# Altium schematic sheet Processor_3.SchDoc
size 420 x 297 mm; CmpIndex: 88; SymIndex: 30
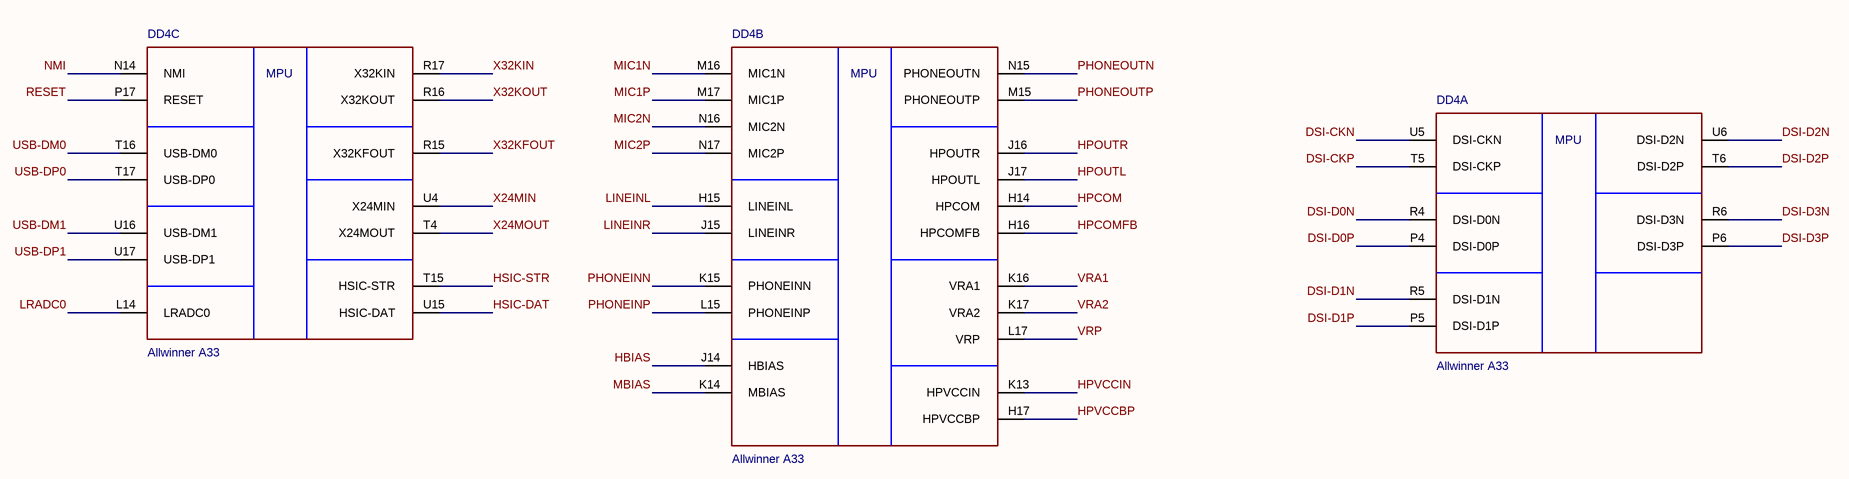
[diagram p0: Processor_3.SchDoc]

## Parts
DD4  Allwinner A33  (parts A,B,C of 7)

## Nets
DSI-CKN: DD4.U5(DSI-CKN)
DSI-CKP: DD4.T5(DSI-CKP)
DSI-D0N: DD4.R4(DSI-D0N)
DSI-D0P: DD4.P4(DSI-D0P)
DSI-D1N: DD4.R5(DSI-D1N)
DSI-D1P: DD4.P5(DSI-D1P)
DSI-D2N: DD4.U6(DSI-D2N)
DSI-D2P: DD4.T6(DSI-D2P)
DSI-D3N: DD4.R6(DSI-D3N)
DSI-D3P: DD4.P6(DSI-D3P)
HBIAS: DD4.J14(HBIAS)
HPCOM: DD4.H14(HPCOM)
HPCOMFB: DD4.H16(HPCOMFB)
HPOUTL: DD4.J17(HPOUTL)
HPOUTR: DD4.J16(HPOUTR)
HPVCCBP: DD4.H17(HPVCCBP)
HPVCCIN: DD4.K13(HPVCCIN)
HSIC-DAT: DD4.U15(HSIC-DAT)
HSIC-STR: DD4.T15(HSIC-STR)
LINEINL: DD4.H15(LINEINL)
LINEINR: DD4.J15(LINEINR)
LRADC0: DD4.L14(LRADC0)
MBIAS: DD4.K14(MBIAS)
MIC1N: DD4.M16(MIC1N)
MIC1P: DD4.M17(MIC1P)
MIC2N: DD4.N16(MIC2N)
MIC2P: DD4.N17(MIC2P)
NMI: DD4.N14(NMI)
PHONEINN: DD4.K15(PHONEINN)
PHONEINP: DD4.L15(PHONEINP)
PHONEOUTN: DD4.N15(PHONEOUTN)
PHONEOUTP: DD4.M15(PHONEOUTP)
RESET: DD4.P17(RESET)
USB-DM0: DD4.T16(USB-DM0)
USB-DM1: DD4.U16(USB-DM1)
USB-DP0: DD4.T17(USB-DP0)
USB-DP1: DD4.U17(USB-DP1)
VRA1: DD4.K16(VRA1)
VRA2: DD4.K17(VRA2)
VRP: DD4.L17(VRP)
X24MIN: DD4.U4(X24MIN)
X24MOUT: DD4.T4(X24MOUT)
X32KFOUT: DD4.R15(X32KFOUT)
X32KIN: DD4.R17(X32KIN)
X32KOUT: DD4.R16(X32KOUT)

## Notes on the sheet
- Лист
- Изм.
- № Докум.
- Подп.
- Дата
- (in symbol Allwinner A33, part A) MPU
- (in symbol Allwinner A33, part B) MPU
- (in symbol Allwinner A33, part C) MPU

## Library data of the parts
DD4 = Allwinner A33: CmpIndex: 86; DXDB_LIBNAME: Embedded Microprocessors; Ref Designator: DD4; SymIndex: 38; Orientation: 0 = 0; Part Label: Allwinner A33; Part Name: Allwinner A33; Part Number NP: Allwinner A33; Part Number: Allwinner A33